# Altium schematic sheet 14_PoE_USB_PD.SchDoc: PoE and USB PD (part 3 of 3)
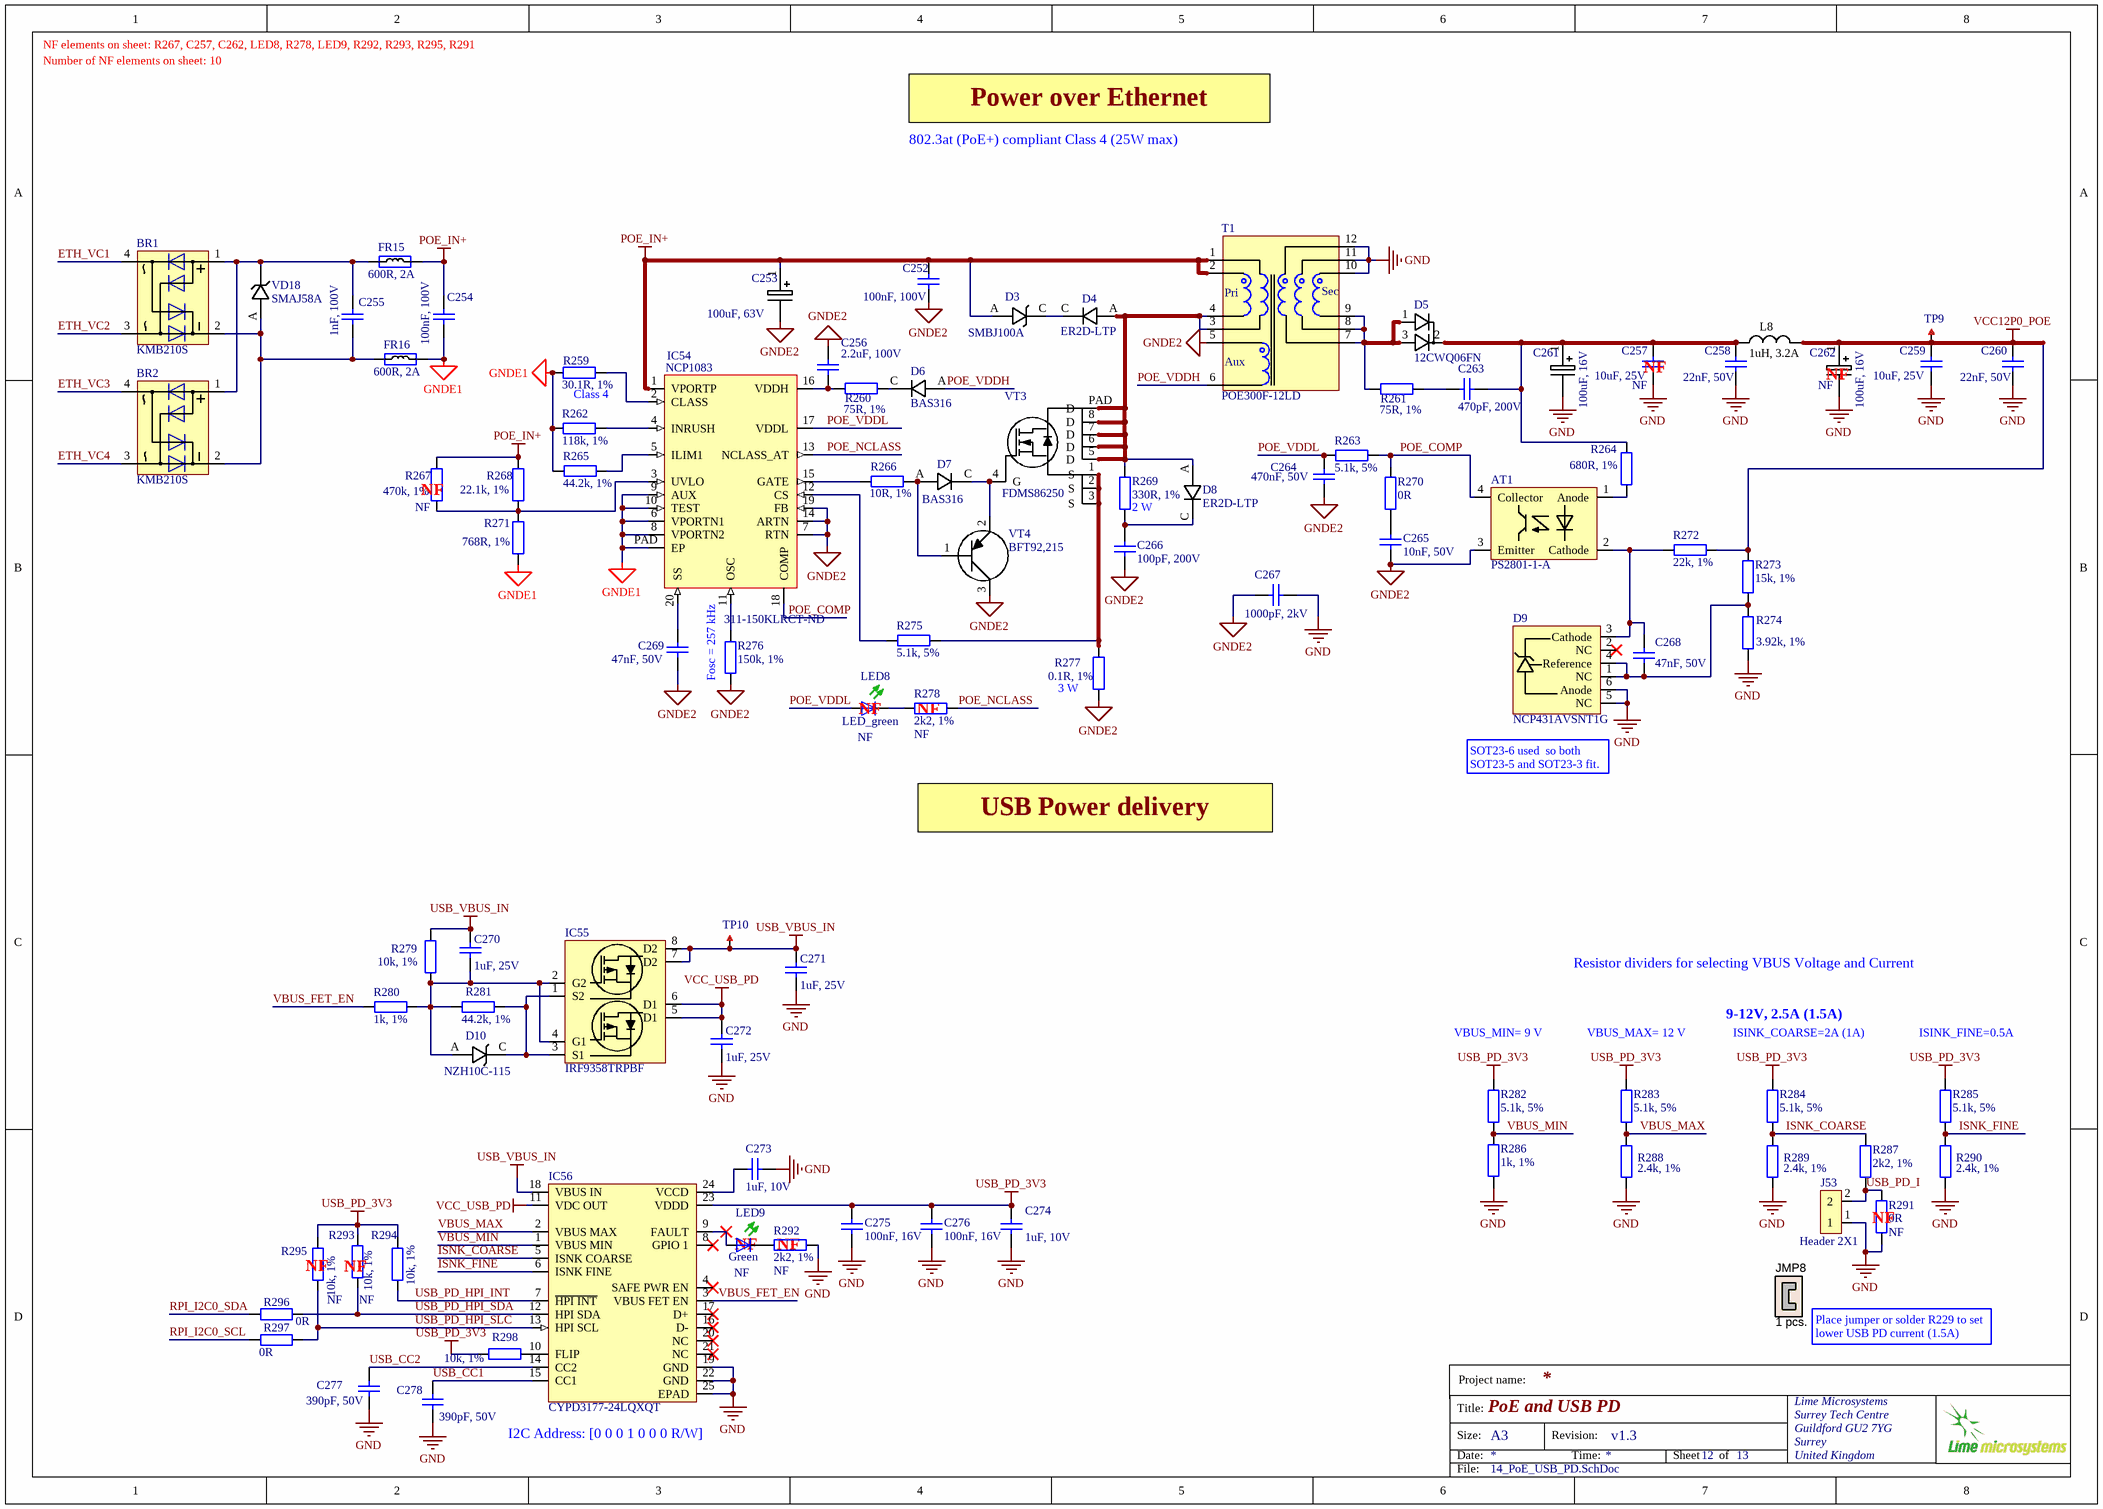
[diagram p2: 14_PoE_USB_PD.SchDoc]

## Library data of the parts (continued)
R259 = Res_0402: Part Description: 30.1 Ohms ±1% 0.063W, 1/16W Chip Resistor 0402 (1005 Metric) Automotive AEC-Q200 Thick Film; Manufacturer: Stackpole Electronics; Manufacturer Part Number 1: RMCF0402FT30R1; Max Power Dissipation: 63mW; Temperature Coefficient: 100ppm/°C; ComponentLink1URL: http://www.yageo.com/documents/recent/PYu-RC0402_51_RoHS_L_6.pdf; ComponentLink1Description: http://www.yageo.com/documents/recent/PYu-RC0402_51_RoHS_L_6.pdf; ComponentLink2URL: https://www.verical.com/server-webapp/html/getDatasheet?partID=29250; ComponentLink2Description: https://www.verical.com/server-webapp/html/getDatasheet?partID=29250; Supplier 1: Digi-Key; Supplier Part Number 1: RMCF0402FT30R1CT-ND; Stock 1: 64826; Pricing 1: 1=0,10000, 10=0,01500, 100=0,00610, 1000=0,00274, 2500=0,00238, 5000=0,00197 (USD); RoHS: Yes; Mount: Surface Mount; Case/Package: 0402; Case Code (Metric): 1005; Case Code (Imperial): 0402; Contact Plating: Tin,Matte; Min Operating Temperature: -55°C; Max Operating Temperature: 155°C; Resistance: 30.1R; Tolerance: 1%; Packaging: Tape and Reel; Resistor Type: Thick Film; Number of Terminations: 2; Features: Automotive AEC-Q200; Series: RMCF; Length: 0.039inch; Width: 0.02inch; Height: 0.016inch; Radiation Hardening: No; Lead Free: Lead Free; RoHS Compliant: Yes; ComponentLink3URL: https://www.seielect.com/Catalog/SEI-RMCF_RMCP.pdf?src-supplier=Digi-Key; ComponentLink3Description: https://www.seielect.com/Catalog/SEI-RMCF_RMCP.pdf?src-supplier=Digi-Key; ComponentLink4URL: https://www.seielect.com/catalog/SEI-Packaging.pdf?src-supplier=Digi-Key; ComponentLink4Description: https://www.seielect.com/catalog/SEI-Packaging.pdf?src-supplier=Digi-Key; ComponentLink5URL: https://www.seielect.com/catalog/SEI-RMCF_RMCP.pdf?src-supplier=Avnet; ComponentLink5Description: https://www.seielect.com/catalog/SEI-RMCF_RMCP.pdf?src-supplier=Avnet
R260 R261 = Res_0603: Part Description: RES SMD 75 OHM 1% 1/16W 0402; Manufacturer: Cyntec; Manufacturer Part Number 1: PFR05S-750-FNH; Supplier 1: Digi-Key; Supplier Part Number 1: 2037-PFR05S-750-FNHDKR-ND; Stock 1: 502756; Pricing 1: 1=0,10000, 10=0,01500, 100=0,00590, 1000=0,00265, 2500=0,00230, 5000=0,00190 (USD); RoHS: Yes; RoHS Compliant: Yes
R262 = Res_0402: Manufacturer: Yageo; Manufacturer Part Number 1: RC0402FR-07118KL; Part Description: 118 kOhms ±1% 0.063W, 1/16W Chip Resistor 0402 (1005 Metric) Moisture Resistant Thick Film; Temperature Coefficient: ±100ppm/°C; Power (Watts): 0.063W, 1/16W; Value: 118k, 1%; Package / Case: 0402 (1005 Metric); Packaging: Cut Tape (CT); Supplier Device Package: 0402; Features: Moisture Resistant; Part Status: Active; Failure Rate: -; Composition: Thick Film; Operating Temperature: -55°C ~ 155°C; Category: Resistors; Tolerance: ±1%; Supplier Part Number 1: YAG2369CT-ND; Supplier 1: Digi-Key; Size / Dimension: 0.039" L x 0.020" W (1.00mm x 0.50mm); RoHS: RoHS Compliant; Height - Seated (Max): 0.016" (0.40mm)
R263 R275 R282-R285 = Res_0603: Part Description: RES 5.1K OHM 5% 1/16W 0402; Manufacturer: Yageo; Manufacturer Part Number 1: RC0402JR-075K1L; Voltage Rating: 50V; Resistance: 5.1kR; Power Rating: 62.5mW; Temperature Coefficient: 100ppm/°C; Max Power Dissipation: 63mW; Supplier 1: Digi-Key; Supplier Part Number 1: 311-5.1KJRCT-ND; Stock 1: 1066675; Pricing 1: 1=0,10000, 10=0,01300, 100=0,00520, 1000=0,00233, 2500=0,00202, 5000=0,00167 (USD); RoHS: Yes; Case/Package: 0402; Case Code (Imperial): 0402; Case Code (Metric): 1005; Weight: 2.3E-05oz; Size Code: 0402; Min Operating Temperature: -55°C; Max Operating Temperature: 155°C; Packaging: Tape and Reel; Tolerance: 5%; Resistor Type: Thick Film; Termination: SMD/SMT; Voltage Rating (DC): 50V; Features: Moisture Resistant; Series: RC; Number of Terminations: 2; Construction: Rectangular; Resistance Tolerance: 5%; Length: 1mm; Width: 0.5mm; Height: 0.35mm; Depth: 0.5mm; REACH SVHC: No SVHC; Military Standard: Not; Lead Free: Lead Free; RoHS Compliant: Yes; ComponentLink1URL: https://datasheet.ciiva.com/7983/1018594-7983595.pdf?src-supplier=Element14; ComponentLink1Description: https://datasheet.ciiva.com/7983/1018594-7983595.pdf?src-supplier=Element14; ComponentLink2URL: https://datasheet.ciiva.com/16740/pyu-rc0402-51-rohs-l-6-r-16740925.pdf?src-supplier=Future+Electronics; ComponentLink2Description: https://datasheet.ciiva.com/16740/pyu-rc0402-51-rohs-l-6-r-16740925.pdf?src-supplier=Future+Electronics
R264 = Res_0402: Manufacturer: Yageo; Manufacturer Part Number 1: RC0402FR-07680RL; Part Description: 680 Ohms ±1% 0.063W, 1/16W Chip Resistor 0402 (1005 Metric) Moisture Resistant Thick Film; Temperature Coefficient: 100ppm/°C; Power Rating: 63mW; Voltage Rating: 50V; Value: 680R, 1%; Supplier 1: Digi-Key; Supplier Part Number 1: 311-680LRCT-ND; Stock 1: 1817297; Pricing 1: 1=0.1, 10=0.016, 100=0.0067, 1000=0.00301, 2500=0.00261, 5000=0.00215 (USD); Case/Package: 0402; Case Code (Imperial): 0402; Case Code (Metric): 1005; Min Operating Temperature: -55°C; Max Operating Temperature: 155°C; Tolerance: 1%; Packaging: Tape and Reel; Resistance: 680R; Composition: Thick Film; Termination: SMD/SMT; Military Standard: Not; Length: 1mm; Depth: 0.5mm; Lead Free: Lead Free; REACH SVHC: No SVHC; ComponentLink1URL: http://www.farnell.com/datasheets/1018594.pdf; ComponentLink1Description: http://www.farnell.com/datasheets/1018594.pdf; ComponentLink2URL: http://www.mouser.com/ds/2/447/PYu-RC0402_51_RoHS_L_6_r-8721.pdf; ComponentLink2Description: http://www.mouser.com/ds/2/447/PYu-RC0402_51_RoHS_L_6_r-8721.pdf; ComponentLink3URL: http://www.yageo.com/documents/recent/PYu-RC0402_51_RoHS_L_6_r.pdf; ComponentLink3Description: http://www.yageo.com/documents/recent/PYu-RC0402_51_RoHS_L_6_r.pdf
R265 R281 = Res_0402: Manufacturer Part Number 1: ERJ-2RKF4422X; Manufacturer: Panasonic Electronic Components; Part Description: RES SMD 44.2K OHM 1% 1/10W 0402; Power (Watts): 0.1W, 1/10W; Temperature Coefficient: ±100ppm/°C; Value: 44.2k, 1%; Supplier 1: Digi-Key; Supplier Part Number 1: P44.2KLCT-ND; Tolerance: ±1%; Supplier Device Package: 0402; Packaging: Cut Tape (CT); Size / Dimension: 0.039" L x 0.020" W (1.00mm x 0.50mm); Features: Automotive AEC-Q200; Package / Case: 0402 (1005 Metric); Height: 0.016" (0.40mm); Operating Temperature: -55°C ~ 155°C; Number of Terminations: 2; Composition: Thick Film; Resistance (Ohms): 44.2k; RoHS: RoHS Compliant; Category: Resistors
R266 = Res_0603: Manufacturer: Vishay; Manufacturer Part Number 1: CRCW060310R0FKEAC; Part Description: 10 Ohms ±1% 0.1W, 1/10W Chip Resistor 0603 (1608 Metric)  Thick Film; Power Rating: 100mW; Value: 10R, 1%; Supplier 1: Digi-Key; Supplier Part Number 1: 541-3952-1-ND; Stock 1: 763669; Pricing 1: 1=0.1, 10=0.03, 100=0.0123, 1000=0.00554, 2500=0.00481 (USD); Case/Package: 0603; Resistance: 10R; Tolerance: 1%; Lead Free: Lead Free
R267 = Res_0402: Manufacturer: TE Connectivity; Manufacturer Part Number 1: CRGCQ0402F470K; Part Description: 470 kOhms ±1% 0.063W, 1/16W Chip Resistor 0402 (1005 Metric) Automotive AEC-Q200, Moisture Resistant Thick Film; ComponentLink1URL: http://www.yageo.com/documents/recent/PYu-RC_Group_51_RoHS_L_9.pdf; ComponentLink1Description: http://www.yageo.com/documents/recent/PYu-RC_Group_51_RoHS_L_9.pdf; ComponentLink2URL: http://www.yageo.com/documents/recent/PYu-RC_Group_51_RoHS_L_10.pdf; ComponentLink2Description: http://www.yageo.com/documents/recent/PYu-RC_Group_51_RoHS_L_10.pdf; ComponentLink3URL: http://www.mouser.com/ds/2/447/PYu-RC0402_51_RoHS_L_6_r-8721.pdf; ComponentLink3Description: http://www.mouser.com/ds/2/447/PYu-RC0402_51_RoHS_L_6_r-8721.pdf; ComponentLink4URL: http://www.yageo.com/documents/recent/PYu-RC0402_51_RoHS_L_6.pdf; ComponentLink4Description: http://www.yageo.com/documents/recent/PYu-RC0402_51_RoHS_L_6.pdf; ComponentLink5URL: http://www.yageo.com/documents/recent/PYu-RC0402_51_RoHS_L_6_r.pdf; ComponentLink5Description: http://www.yageo.com/documents/recent/PYu-RC0402_51_RoHS_L_6_r.pdf; Supplier 1: Digi-Key; Supplier Part Number 1: A129659CT-ND; Stock 1: 428220; Pricing 1: 1=0,10000, 10=0,02600, 100=0,01070, 1000=0,00478, 2500=0,00415, 5000=0,00343 (USD); RoHS: Yes; ComponentLink6URL: https://www.te.com/commerce/DocumentDelivery/DDEController?Action=srchrtrv&DocNm=1773204-3&DocType=DS&DocLang=English&src-supplier=Digi-Key; ComponentLink6Description: https://www.te.com/commerce/DocumentDelivery/DDEController?Action=srchrtrv&DocNm=1773204-3&DocType=DS&DocLang=English&src-supplier=Digi-Key; ComponentLink7URL: https://www.te.com/commerce/DocumentDelivery/DDEController?Action=srchrtrv&amp;DocNm=1773204-3&amp;DocType=DS&amp;DocLang=English&src-supplier=Digi-Key; ComponentLink7Description: https://www.te.com/commerce/DocumentDelivery/DDEController?Action=srchrtrv&amp;DocNm=1773204-3&amp;DocType=DS&amp;DocLang=English&src-supplier=Digi-Key; ComponentLink8URL: https://4donline.ihs.com/images/VipMasterIC/IC/TYEL/TYEL-S-A0004929575/TYEL-S-A0004929575-1.pdf?hkey=52A5661711E402568146F3353EA87419&src-supplier=Newark; ComponentLink8Description: https://4donline.ihs.com/images/VipMasterIC/IC/TYEL/TYEL-S-A0004929575/TYEL-S-A0004929575-1.pdf?hkey=52A5661711E402568146F3353EA87419&src-supplier=Newark; ComponentLink9URL: https://4donline.ihs.com/images/VipMasterIC/IC/TYEL/TYEL-S-A0004929575/TYEL-S-A0004929575-1.pdf?hkey=52A5661711E402568146F3353EA87419&src-supplier=Farnell; ComponentLink9Description: https://4donline.ihs.com/images/VipMasterIC/IC/TYEL/TYEL-S-A0004929575/TYEL-S-A0004929575-1.pdf?hkey=52A5661711E402568146F3353EA87419&src-supplier=Farnell
R268 = Res_0402: Part Description: RES SMD 22.1K OHM 1% 1/16W 0402; Manufacturer: Yageo; Manufacturer Part Number 1: AC0402FR-0722K1L; Resistance: 22.1kR; Max Power Dissipation: 63mW; Temperature Coefficient: 100ppm/°C; Value: 22.1k, 1%; ComponentLink1URL: http://www.yageo.com/documents/recent/PYu-RC_Group_51_RoHS_L_9.pdf; ComponentLink1Description: http://www.yageo.com/documents/recent/PYu-RC_Group_51_RoHS_L_9.pdf; ComponentLink2URL: http://www.yageo.com/documents/recent/PYu-RC_Group_51_RoHS_L_10.pdf; ComponentLink2Description: http://www.yageo.com/documents/recent/PYu-RC_Group_51_RoHS_L_10.pdf; ComponentLink3URL: http://www.mouser.com/ds/2/447/PYu-RC0402_51_RoHS_L_6_r-8721.pdf; ComponentLink3Description: http://www.mouser.com/ds/2/447/PYu-RC0402_51_RoHS_L_6_r-8721.pdf; ComponentLink4URL: http://www.yageo.com/documents/recent/PYu-RC0402_51_RoHS_L_6.pdf; ComponentLink4Description: http://www.yageo.com/documents/recent/PYu-RC0402_51_RoHS_L_6.pdf; ComponentLink5URL: http://www.yageo.com/documents/recent/PYu-RC0402_51_RoHS_L_6_r.pdf; ComponentLink5Description: http://www.yageo.com/documents/recent/PYu-RC0402_51_RoHS_L_6_r.pdf; Supplier 1: Digi-Key; Supplier Part Number 1: YAG3457CT-ND; Stock 1: 106000; Pricing 1: 1=0,10000, 10=0,01900, 100=0,00790, 1000=0,00353, 2500=0,00307, 5000=0,00253 (USD); RoHS: Yes; Case/Package: 0402; Case Code (Metric): 1005; Case Code (Imperial): 0402; Min Operating Temperature: -55°C; Max Operating Temperature: 155°C; Packaging: Tape and Reel; Resistor Type: Thick Film; Number of Terminations: 2; Tolerance: 1%; Features: Moisture Resistant,Automotive AEC-Q200; Length: 0.039inch; Width: 0.02inch; Height: 0.015inch; RoHS Compliant: Yes; ComponentLink6URL: http://www.yageo.com/NewPortal/yageodocoutput?fileName=/pdf/R-Chip/PYu-AC_51_RoHS_L_6.pdf&src-supplier=Digi-Key; ComponentLink6Description: http://www.yageo.com/NewPortal/yageodocoutput?fileName=/pdf/R-Chip/PYu-AC_51_RoHS_L_6.pdf&src-supplier=Digi-Key
R269 = Res_0603: Part Description: RES 330 OHM 1% 2W 2512; Manufacturer: TE Connectivity; Manufacturer Part Number 1: CRGP2512F330R; Supplier 1: Digi-Key; Supplier Part Number 1: A130715CT-ND; Stock 1: 59724; Pricing 1: 1=0,69000, 10=0,49600, 100=0,25810, 1000=0,13899 (USD); RoHS: Yes; ComponentLink1URL: https://www.te.com/commerce/DocumentDelivery/DDEController?Action=srchrtrv&amp;DocNm=9-1773463-9&amp;DocType=DS&amp;DocLang=English&src-supplier=Digi-Key; ComponentLink1Description: https://www.te.com/commerce/DocumentDelivery/DDEController?Action=srchrtrv&amp;DocNm=9-1773463-9&amp;DocType=DS&amp;DocLang=English&src-supplier=Digi-Key
R270 R291 R296 R297 = Res_0402: Manufacturer Part Number 1: RC0402JR-070RL; Manufacturer: Yageo; Part Description: RES SMD 0.0OHM JUMPER 1/16W 0402; Resistance (Ohms): 0.0; Tolerance: Jumper; Power (Watts): 0.063W, 1/16W; Value: 0R; Supplier 1: Digi-Key; Supplier Part Number 1: 311-0.0JRTR-ND; Category: Resistors; Temperature Coefficient: -; Features: Moisture Resistant; Supplier Device Package: 0402; Height: 0.016" (0.40mm); Package / Case: 0402 (1005 Metric); Operating Temperature: -55°C ~ 155°C; Size / Dimension: 0.039" L x 0.020" W (1.00mm x 0.50mm); Composition: Thick Film; Packaging: Tape & Reel (TR); Number of Terminations: 2; RoHS: RoHS Compliant
R271 = Res_0402: Part Description: RES 768 OHM 1% 1/16W 0402; Manufacturer: Yageo; Manufacturer Part Number 1: RC0402FR-07768RL; Temperature Coefficient: 100ppm/°C; Power Rating: 62.5mW; Voltage Rating: 50V; Max Power Dissipation: 63mW; ComponentLink1URL: https://www.seielect.com/Catalog/SEI-RMCF_RMCP.pdf?src-supplier=Avnet; ComponentLink1Description: https://www.seielect.com/Catalog/SEI-RMCF_RMCP.pdf?src-supplier=Avnet; ComponentLink2URL: https://www.seielect.com/catalog/SEI-Packaging.pdf?src-supplier=Digi-Key; ComponentLink2Description: https://www.seielect.com/catalog/SEI-Packaging.pdf?src-supplier=Digi-Key; ComponentLink3URL: https://www.seielect.com/Catalog/SEI-RMCF_RMCP.pdf?src-supplier=Digi-Key; ComponentLink3Description: https://www.seielect.com/Catalog/SEI-RMCF_RMCP.pdf?src-supplier=Digi-Key; Supplier 1: Digi-Key; Supplier Part Number 1: YAG3229CT-ND; Stock 1: 281209; Pricing 1: 1=0,10000, 10=0,01400, 100=0,00580, 1000=0,00262, 2500=0,00228, 5000=0,00188 (USD); RoHS: Yes; Case/Package: 0402; Contact Plating: Tin,Matte; Case Code (Imperial): 0402; Case Code (Metric): 1005; Size Code: 0402; Min Operating Temperature: -55°C; Max Operating Temperature: 155°C; Resistance: 768R; Tolerance: 1%; Resistor Type: Thick Film; Packaging: Tape and Reel; Number of Terminations: 2; Termination: SMD/SMT; Features: Moisture Resistant; Series: RC; Construction: Rectangular; Length: 1mm; Width: 0.02inch; Height: 0.016inch; Depth: 0.5mm; Military Standard: Not; Lead Free: Lead Free; RoHS Compliant: Yes; ComponentLink4URL: https://datasheet.ciiva.com/8884/pyu-rc0402-51-rohs-l-6-8884831.pdf?src-supplier=Avnet; ComponentLink4Description: https://datasheet.ciiva.com/8884/pyu-rc0402-51-rohs-l-6-8884831.pdf?src-supplier=Avnet; Value: 768R, 1%
R272 = Res_0402: Manufacturer: Yageo; Part Description: RES SMD 22K OHM 1% 1/16W 0402; Manufacturer Part Number 1: RC0402FR-0722KL; Temperature Coefficient: ±100ppm/°C; Power (Watts): 0.063W, 1/16W; Value: 22k, 1%; Number of Terminations: 2; Operating Temperature: -55°C ~ 155°C; Package / Case: 0402 (1005 Metric); Category: Resistors; Size / Dimension: 0.039" L x 0.020" W (1.00mm x 0.50mm); Height: 0.016" (0.40mm); Supplier 1: Digi-Key; Supplier Part Number 1: 311-22.0KLRCT-ND; RoHS: RoHS Compliant; Features: Moisture Resistant; Packaging: Cut Tape (CT); Composition: Thick Film; Supplier Device Package: 0402; Resistance (Ohms): 22k; Tolerance: ±1%
R273 = Res_0402: Part Description: Thick Film Resistors - SMD 15 kOhms 62.5 mW 0402 1% AEC-Q200; Manufacturer: Yageo; Manufacturer Part Number 1: AC0402FR-0715KL; Voltage Rating: 50V; Resistance: 15kR; Power Rating: 62.5mW; Max Power Dissipation: 63mW; Temperature Coefficient: 100ppm/°C; Value: 15k, 1%; Supplier 1: Digi-Key; Supplier Part Number 1: YAG3444CT-ND; Stock 1: 358225; Pricing 1: 1=0,10000, 10=0,02100, 100=0,00860, 1000=0,00385, 2500=0,00334, 5000=0,00276 (USD); RoHS: Yes; Case/Package: 0402; Case Code (Imperial): 0402; Case Code (Metric): 1005; Weight: 2.3E-05oz; Min Operating Temperature: -55°C; Max Operating Temperature: 155°C; Tolerance: 1%; Packaging: Tape and Reel; Resistor Type: Thick Film; Number of Terminations: 2; Termination: SMD/SMT; Features: Moisture Resistant,Automotive AEC-Q200; Series: AC; Length: 0.039inch; Width: 0.02inch; Height: 0.015inch; RoHS Compliant: Yes; ComponentLink1URL: https://datasheet.ciiva.com/12576/pyu-ac-51-rohs-l-2-12576779.pdf?src-supplier=Mouser; ComponentLink1Description: https://datasheet.ciiva.com/12576/pyu-ac-51-rohs-l-2-12576779.pdf?src-supplier=Mouser
R274 = Res_0402: Manufacturer: Yageo; Manufacturer Part Number 1: RC0402FR-073K92L; Part Description: 3.92 kOhms ±1% 0.063W, 1/16W Chip Resistor 0402 (1005 Metric) Moisture Resistant Thick Film; Resistance: 3.92kR; Power Rating: 62.5mW; Voltage Rating: 50V; Temperature Coefficient: 100ppm/°C; Max Power Dissipation: 63mW; Value: 3.92k, 1%; Supplier 1: Digi-Key; Supplier Part Number 1: 311-3.92KLRCT-ND; Stock 1: 643857; Pricing 1: 1=0,10000, 10=0,01500, 100=0,00610, 1000=0,00275, 2500=0,00239, 5000=0,00197 (USD); RoHS: Yes; Case/Package: 0402; Case Code (Imperial): 0402; Case Code (Metric): 1005; Contact Plating: Tin,Lead,Matte; Min Operating Temperature: -55°C; Max Operating Temperature: 155°C; Tolerance: 1%; Packaging: Tape and Reel; Package Quantity: 1; Termination: SMD/SMT; Resistor Type: Thick Film; Number of Terminations: 2; Voltage Rating (DC): 50V; Working Voltage: 50V; Features: Moisture Resistant; Series: RC; Technology: THICK FILM; Construction: Rectangular; Length: 1mm; Width: 0.02inch; Height: 0.016inch; Depth: 0.5mm; Radiation Hardening: No; Military Standard: Not; Lead Free: Lead Free; RoHS Compliant: Yes; ComponentLink1URL: https://datasheet.ciiva.com/2491/pyu-r-int-thick-7-2491277.pdf?src-supplier=Digi-Key; ComponentLink1Description: https://datasheet.ciiva.com/2491/pyu-r-int-thick-7-2491277.pdf?src-supplier=Digi-Key; ComponentLink2URL: https://datasheet.ciiva.com/2491/pyu-r-int-thick-7-2491278.pdf?src-supplier=Digi-Key; ComponentLink2Description: https://datasheet.ciiva.com/2491/pyu-r-int-thick-7-2491278.pdf?src-supplier=Digi-Key; ComponentLink3URL: https://datasheet.ciiva.com/2491/pyu-r-int-thick-7-2491276.pdf?src-supplier=Digi-Key; ComponentLink3Description: https://datasheet.ciiva.com/2491/pyu-r-int-thick-7-2491276.pdf?src-supplier=Digi-Key; ComponentLink4URL: https://datasheet.ciiva.com/16742/pyu-rc0402-51-rohs-l-6-r-16742934.pdf?src-supplier=Future+Electronics; ComponentLink4Description: https://datasheet.ciiva.com/16742/pyu-rc0402-51-rohs-l-6-r-16742934.pdf?src-supplier=Future+Electronics; ComponentLink5URL: https://datasheet.ciiva.com/15189/getdatasheetpartid-327870-15189452.pdf?src-supplier=Verical; ComponentLink5Description: https://datasheet.ciiva.com/15189/getdatasheetpartid-327870-15189452.pdf?src-supplier=Verical
R276 = Res_0402: Part Description: RES 150K OHM 1% 1/16W 0402; Manufacturer: Yageo; Manufacturer Part Number 1: RC0402FR-07150KL; Resistance: 150kR; Power Rating: 63mW; Voltage Rating: 50V; Temperature Coefficient: 100ppm/°C; Value: 150k, 1%; Supplier 1: Digi-Key; Stock 1: 1065666; Pricing 1: 1=0,1, 10=0,015, 100=0,0073, 1000=0,00417, 2500=0,00342, 5000=0,00297 (USD); RoHS: Yes; Case/Package: 0402; Number of Pins: 2; Case Code (Metric): 1005; Case Code (Imperial): 0402; Min Operating Temperature: -55°C; Max Operating Temperature: 155°C; Package Quantity: 1; Tolerance: 1%; Packaging: Tape and Reel; Resistor Type: Thick Film; Number of Terminations: 2; Termination: SMD/SMT; Max Power Dissipation: 63mW; Features: Moisture Resistant; Series: RC; Resistance Tolerance: 1%; Construction: Rectangular; Technology: THICK FILM; Voltage Rating (DC): 50V; Working Voltage: 50V; Length: 1mm; Width: 0.5mm; Height: 0.016inch; Depth: 0.5mm; Reach SVHC Compliant: No; Military Standard: Not; Lead Free: Lead Free; RoHS Compliant: Yes; ComponentLink1URL: https://datasheet.ciiva.com/6067/1686128-6067913.pdf?src-supplier=Farnell; ComponentLink1Description: https://datasheet.ciiva.com/6067/1686128-6067913.pdf?src-supplier=Farnell; ComponentLink2URL: https://datasheet.ciiva.com/7983/1018594-7983494.pdf?src-supplier=Element14; ComponentLink2Description: https://datasheet.ciiva.com/7983/1018594-7983494.pdf?src-supplier=Element14; ComponentLink3URL: https://datasheet.ciiva.com/2453/pyu-r-int-thick-7-2453602.pdf?src-supplier=Digi-Key; ComponentLink3Description: https://datasheet.ciiva.com/2453/pyu-r-int-thick-7-2453602.pdf?src-supplier=Digi-Key; ComponentLink4URL: https://datasheet.ciiva.com/2453/pyu-r-int-thick-7-2453603.pdf?src-supplier=Digi-Key; ComponentLink4Description: https://datasheet.ciiva.com/2453/pyu-r-int-thick-7-2453603.pdf?src-supplier=Digi-Key; ComponentLink5URL: https://datasheet.ciiva.com/2453/pyu-r-int-thick-7-2453601.pdf?src-supplier=Digi-Key; ComponentLink5Description: https://datasheet.ciiva.com/2453/pyu-r-int-thick-7-2453601.pdf?src-supplier=Digi-Key; ComponentLink6URL: https://datasheet.ciiva.com/7849/1018594-7849837.pdf?src-supplier=Element14; ComponentLink6Description: https://datasheet.ciiva.com/7849/1018594-7849837.pdf?src-supplier=Element14; ComponentLink7URL: https://datasheet.ciiva.com/7849/1018594-7849836.pdf?src-supplier=Element14; ComponentLink7Description: https://datasheet.ciiva.com/7849/1018594-7849836.pdf?src-supplier=Element14; ComponentLink8URL: https://datasheet.ciiva.com/15189/getdatasheetpartid-326416-15189356.pdf?src-supplier=Verical; ComponentLink8Description: https://datasheet.ciiva.com/15189/getdatasheetpartid-326416-15189356.pdf?src-supplier=Verical; ComponentLink9URL: https://datasheet.ciiva.com/16741/pyu-rc0402-51-rohs-l-6-r-16741080.pdf?src-supplier=Future+Electronics; ComponentLink9Description: https://datasheet.ciiva.com/16741/pyu-rc0402-51-rohs-l-6-r-16741080.pdf?src-supplier=Future+Electronics
R277 = Res_0603: Part Description: RES 0.1 OHM 1% 3W 2512; Manufacturer: TE Connectivity; Manufacturer Part Number 1: TLRP3A30DR100FTE; Supplier 1: Digi-Key; Supplier Part Number 1: 1712-TLRP3A30DR100FTECT-ND; Stock 1: 4000; Pricing 1: 1=0,58000, 10=0,48300, 25=0,41400, 50=0,37280, 100=0,32440, 250=0,28992, 500=0,23470, 1000=0,18983 (USD); RoHS: No
R278 R287 R292 = Res_0402: Manufacturer: Stackpole Electronics Inc; Manufacturer Part Number 1: RMCF0402FT2K20; Part Description: RES SMD 2.2K OHM 1% 1/16W 0402; Resistance (Ohms): 2.2k; Temperature Coefficient: ±100ppm/°C; Power (Watts): 0.063W, 1/16W; Value: 2k2, 1%; Supplier 1: Digi-Key; Supplier Part Number 1: RMCF0402FT2K20CT-ND; Supplier Device Package: 0402; Package / Case: 0402 (1005 Metric); Size / Dimension: 0.039" L x 0.020" W (1.00mm x 0.50mm); Operating Temperature: -55°C ~ 155°C; Composition: Thick Film; Category: Resistors; Features: -; Height: 0.016" (0.40mm); RoHS: RoHS Compliant; Number of Terminations: 2; Packaging: Cut Tape (CT); Tolerance: ±1%
R279 R293-R295 R298 = Res_0402: Manufacturer: Yageo; Manufacturer Part Number 1: RC0402FR-0710KL; Part Description: RES SMD 10K OHM 1% 1/16W 0402; Temperature Coefficient: ±100ppm/°C; Power (Watts): 0.063W, 1/16W; Value: 10k, 1%; Supplier 1: Digi-Key; Supplier Part Number 1: 311-10.0KLRTR-ND; Resistance (Ohms): 10k; Packaging: Tape & Reel (TR); RoHS: RoHS Compliant; Package / Case: 0402 (1005 Metric); Tolerance: ±1%; Operating Temperature: -55°C ~ 155°C; Size / Dimension: 0.039" L x 0.020" W (1.00mm x 0.50mm); Number of Terminations: 2; Category: Resistors; Height: 0.016" (0.40mm); Supplier Device Package: 0402; Features: Moisture Resistant; Composition: Thick Film
R280 R286 = Res_0402: Manufacturer: Stackpole Electronics Inc; Manufacturer Part Number 1: RMCF0402FT1K00; Part Description: RES SMD 1K OHM 1% 1/16W 0402; Temperature Coefficient: ±100ppm/°C; Power (Watts): 0.063W, 1/16W; Value: 1k, 1%; Supplier 1: Digi-Key; Supplier Part Number 1: RMCF0402FT1K00TR-ND; Package / Case: 0402 (1005 Metric); Supplier Device Package: 0402; Height: 0.016" (0.40mm); Size / Dimension: 0.039" L x 0.020" W (1.00mm x 0.50mm); Number of Terminations: 2; Packaging: Cut Tape (CT); Category: Resistors; Composition: Thick Film; Resistance (Ohms): 1k; Tolerance: ±1%; Features: Moisture Resistant; Operating Temperature: -55°C ~ 155°C; RoHS: RoHS Compliant
R288-R290 = Res_0402: Manufacturer Part Number 1: RC0402FR-072K4L; Manufacturer: Yageo; Part Description: 2.4 kOhms ±1% 0.063W, 1/16W Chip Resistor 0402 (1005 Metric) Moisture Resistant Thick Film; Temperature Coefficient: ±100ppm/°C; Power (Watts): 0.063W, 1/16W; Value: 2.4k, 1%; Package / Case: 0402 (1005 Metric); RoHS: RoHS Compliant; Supplier Part Number 1: 311-2.40KLRCT-ND; Resistance (Ohms): 2.4k; Size / Dimension: 0.039" L x 0.020" W (1.00mm x 0.50mm); Category: Resistors; Part Status: Active; Features: Moisture Resistant; Supplier Device Package: 0402; Failure Rate: -; Tolerance: ±1%; Composition: Thick Film; Packaging: Cut Tape (CT); Operating Temperature: -55°C ~ 155°C; Height - Seated (Max): 0.016" (0.40mm); Supplier 1: Digi-Key
T1 = POE300F-50LD_transformer: Manufacturer: Coilcraft; Part Description: Audio Transformers / Signal Transformers POE300F Flyback PoE+ 30uH 12 V 2.5 A; Resistance: 0.061R; Turns Ratio: 1:0.33; Inductance: 42uH; DC Resistance (DCR): 61mR; Isolation Voltage: 1.5kV; ComponentLink1URL: http://www.mouser.com/ds/2/597/poe300-463486.pdf?src-supplier=Mouser; ComponentLink1Description: http://www.mouser.com/ds/2/597/poe300-463486.pdf?src-supplier=Mouser; Supplier 1: Mouser; Supplier Part Number 1: 994-POE300F-12LD; Manufacturer Part Number 1: POE300F-12LD; Stock 1: 3045; Pricing 1: 1=6,63000, 10=5,98000, 50=5,31000, 100=4,65000, 1000=3,57000, 10000=3,57000 (USD); RoHS: Yes; Packaging: Tape and Reel; Package Quantity: 175; Length: 21mm; Width: 20.57mm; Height: 11.43mm; REACH SVHC: Unknown; Lead Free: Contains Lead; RoHS Compliant: Yes; ComponentLink2URL: http://www.farnell.com/datasheets/1870433.pdf?src-supplier=Farnell; ComponentLink2Description: http://www.farnell.com/datasheets/1870433.pdf?src-supplier=Farnell; ComponentLink3URL: http://www.farnell.com/datasheets/1870433.pdf?src-supplier=Element14; ComponentLink3Description: http://www.farnell.com/datasheets/1870433.pdf?src-supplier=Element14
TP9 TP10 = TESTPOINT_PAD: Test Point PCB mount Miniature White
VD18 = DIODE_TVS_UNIDIR: Manufacturer: Diodes Incorporated; Manufacturer Part Number 1: SMAJ58A-13-F; Part Description: TVS DIODE 58V 93.6V SMA; Current - Peak Pulse (10/1000µs): 4.3A; Power - Peak Pulse: 400W; Power Line Protection: No; Type: Zener; Voltage - Breakdown (Min): 64.4V; Voltage - Clamping (Max) @ Ipp: 93.6V; Voltage - Reverse Standoff (Typ): 58V; Applications: General Purpose; Base Part Number: SMAJ58; Capacitance @ Frequency: -; Category: Circuit Protection; Mounting Type: Surface Mount; Operating Temperature: -55°C ~ 150°C (TJ); Package / Case: DO-214AC, SMA; Packaging: Cut Tape (CT); Part Status: Active; RoHS: RoHS Compliant; Supplier 1: Digi-Key; Supplier Device Package: SMA; Supplier Part Number 1: SMAJ58A-13-FDICT-ND; Value: SMAJ58A
VT3 = FDMS86250_NMOS: MOSFET FET 150V 25.0 MOHM PQFN56; Manufacturer: ON Semiconductor / Fairchild; Continuous Drain Current (ID): 6.7A; Max Power Dissipation: 2.5W; Drain to Source Resistance: 33mR; Power Dissipation: 96W; Number of Elements: 1; Turn-On Delay Time: 14ns; Turn-Off Delay Time: 22ns; Fall Time: 4.2ns; Rds On Max: 25mR; Input Capacitance: 2.33nF; Rise Time: 4.3ns; Element Configuration: Single; Gate to Source Voltage (Vgs): 20V; Supplier 1: Mouser; Stock 1: 2961; Pricing 1: 1=2,77000, 10=2,50000, 50=2,36000, 100=2,01000, 1000=1,37000, 10000=1,32000 (USD); RoHS: Yes; Mount: Surface Mount; Number of Pins: 8; Weight: 0.0681g; Min Operating Temperature: -55°C; Max Operating Temperature: 150°C; Drain to Source Voltage (Vdss): 150V; Drain to Source Breakdown Voltage: 150V; Package Quantity: 3000; Packaging: Tape and Reel; Length: 5mm; Width: 6mm; Height: 1.05mm; Radiation Hardening: No; Lead Free: Lead Free; ComponentLink1URL: https://datasheet.ciiva.com/15043/fdms86250-15043510.pdf?src-supplier=Digi-Key; ComponentLink1Description: https://datasheet.ciiva.com/15043/fdms86250-15043510.pdf?src-supplier=Digi-Key; ComponentLink2URL: https://datasheet.ciiva.com/4440/fdms86250-103923-4440671.pdf?src-supplier=Mouser; ComponentLink2Description: https://datasheet.ciiva.com/4440/fdms86250-103923-4440671.pdf?src-supplier=Mouser; ComponentLink3URL: https://datasheet.ciiva.com/15043/fdms86250-15043511.pdf?src-supplier=Digi-Key; ComponentLink3Description: https://datasheet.ciiva.com/15043/fdms86250-15043511.pdf?src-supplier=Digi-Key; ComponentLink4URL: https://datasheet.ciiva.com/15043/fdms86250-15043512.pdf?src-supplier=Digi-Key; ComponentLink4Description: https://datasheet.ciiva.com/15043/fdms86250-15043512.pdf?src-supplier=Digi-Key; Supplier Part Number 1: 512-FDMS86250; Part Description: MOSFET FET 150V 25.0 MOHM PQFN56; Manufacturer Part Number: FDMS86250; Manufacturer Part Number 1: FDMS86250
VT4 = BFT92,215_PNP: Manufacturer: NXP Semiconductors; Part Description: RF TRANS PNP 15V 5GHZ TO236AB; Manufacturer Part Number: BFT92215; Polarity: PNP; Max Power Dissipation: 300mW; hFE Min: 50; Number of Elements: 1; Emitter Base Voltage (VEBO): 2V; Max Collector Current: 25mA; Frequency: 5GHz; Collector Emitter Voltage (VCEO): 15V; Collector Base Voltage (VCBO): 20V; Gain: 18dB; Element Configuration: Single; Continuous Collector Current: -25mA; Supplier 1: Digi-Key; Stock 1: 0; RoHS: Yes; Mount: Surface Mount; Case/Package: TO-236AB; Number of Pins: 3; Weight: 0.00709oz; Contact Plating: Tin; Min Operating Temperature: -65°C; Max Operating Temperature: 175°C; Packaging: Tape and Reel; Package Quantity: 1; Output Power: 300mW; Transition Frequency: 5GHz; Collector Emitter Breakdown Voltage: 15V; Max Breakdown Voltage: 15V; Power Dissipation: 300mW; Max Frequency: 5GHz; Gain Bandwidth Product: 5GHz; Series: -; Length: 3mm; Width: 1.4mm; Height: 1mm; Radiation Hardening: No; Lead Free: Lead Free; REACH SVHC: No SVHC; ComponentLink1URL: https://datasheet.ciiva.com/29696/1323776-29696333.pdf?src-supplier=Jameco; ComponentLink1Description: https://datasheet.ciiva.com/29696/1323776-29696333.pdf?src-supplier=Jameco; ComponentLink2URL: https://datasheet.ciiva.com/965/bft92-cnv-965053.pdf?src-supplier=Digi-Key; ComponentLink2Description: https://datasheet.ciiva.com/965/bft92-cnv-965053.pdf?src-supplier=Digi-Key; ComponentLink3URL: https://datasheet.ciiva.com/6362/bft92-cnv-6362733.pdf?src-supplier=Digi-Key; ComponentLink3Description: https://datasheet.ciiva.com/6362/bft92-cnv-6362733.pdf?src-supplier=Digi-Key; ComponentLink4URL: https://datasheet.ciiva.com/965/bft92-cnv-965054.pdf?src-supplier=Digi-Key; ComponentLink4Description: https://datasheet.ciiva.com/965/bft92-cnv-965054.pdf?src-supplier=Digi-Key; ComponentLink5URL: https://datasheet.ciiva.com/16221/bft92-cnv-16221865.pdf?src-supplier=Future+Electronics; ComponentLink5Description: https://datasheet.ciiva.com/16221/bft92-cnv-16221865.pdf?src-supplier=Future+Electronics; ComponentLink6URL: https://datasheet.ciiva.com/11198/bft92-cnv-11198214.pdf?src-supplier=Avnet; ComponentLink6Description: https://datasheet.ciiva.com/11198/bft92-cnv-11198214.pdf?src-supplier=Avnet; ComponentLink7URL: https://datasheet.ciiva.com/11204/bft92-cnv-11204747.pdf?src-supplier=Avnet; ComponentLink7Description: https://datasheet.ciiva.com/11204/bft92-cnv-11204747.pdf?src-supplier=Avnet; ComponentLink8URL: https://datasheet.ciiva.com/11204/bft92-cnv-11204828.pdf?src-supplier=Avnet; ComponentLink8Description: https://datasheet.ciiva.com/11204/bft92-cnv-11204828.pdf?src-supplier=Avnet; Supplier Part Number 1: 568-1655-1-ND; Manufacturer Part Number 1: BFT92215